# Altium project Main.PrjPcb
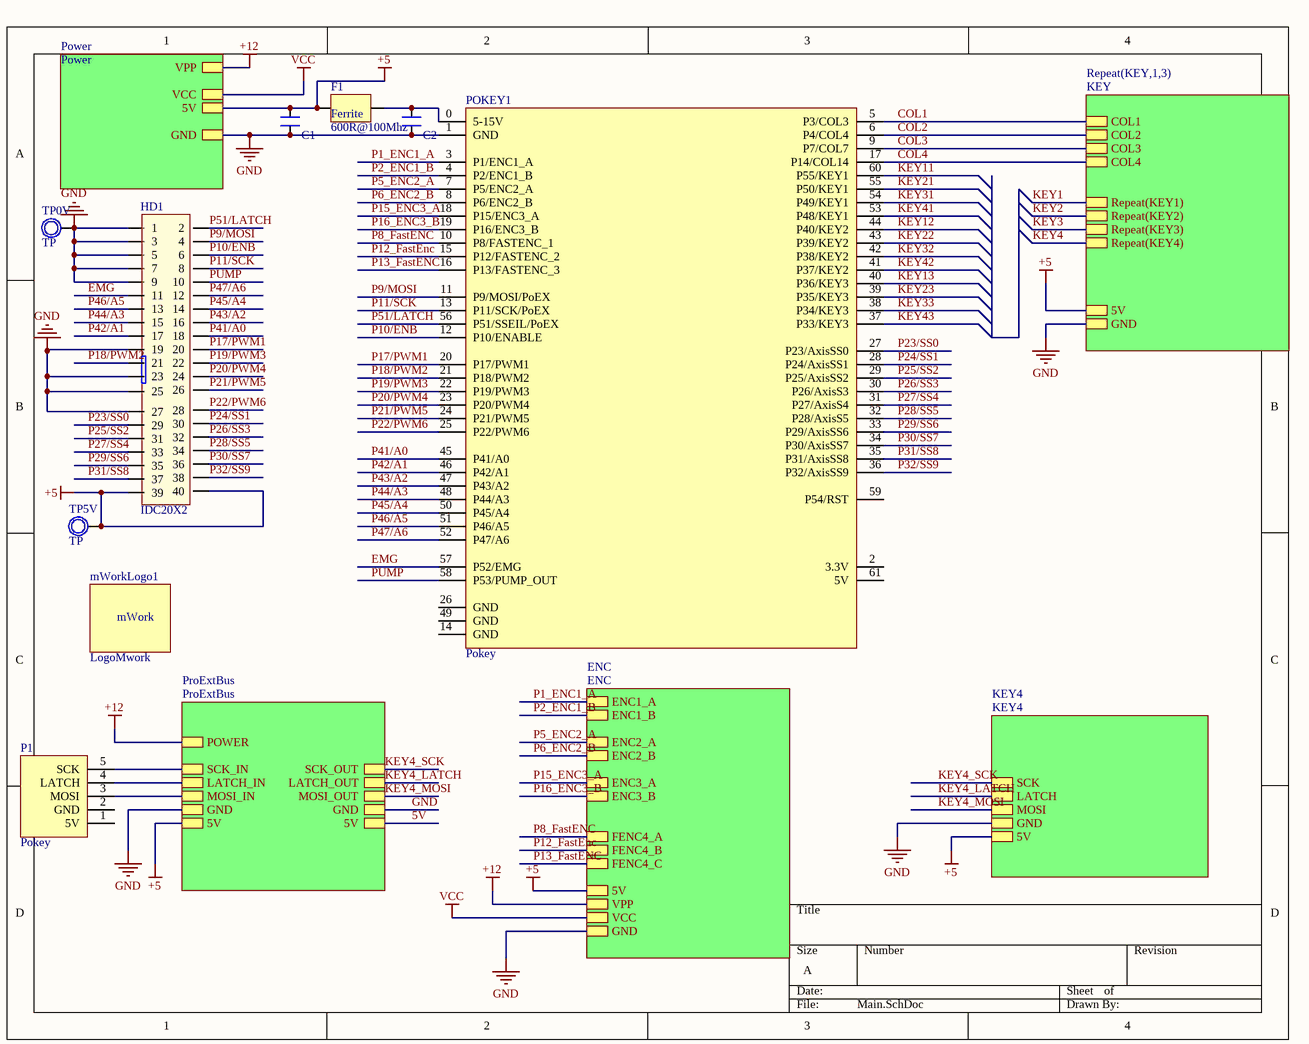
[diagram p0: Main.SchDoc]
9 sheets, 249 parts. Net scope: hierarchical (ports join the sheet entries above them; power ports are global).
Board file: PokeyMain.PcbDoc
Sheets:
  Main.SchDoc
    Power = Power.SchDoc
    ProExtBus = ProExtBus.SchDoc
      Led1 = Led.SchDoc
      Led2 = Led.SchDoc
      Led3 = Led.SchDoc
      Led4 = Led.SchDoc
      Led5 = Led.SchDoc
      Led6 = Led.SchDoc
      Led7 = Led.SchDoc
      Led8 = Led.SchDoc
      Led9 = Led.SchDoc
      Led10 = Led.SchDoc
      Led11 = Led.SchDoc
      Led12 = Led.SchDoc
      Led13 = Led.SchDoc
      Led14 = Led.SchDoc
      Led15 = Led.SchDoc
      Led16 = Led.SchDoc
      Led17 = Led.SchDoc
      Led18 = Led.SchDoc
      Led19 = Led.SchDoc
      Led20 = Led.SchDoc
      Led21 = Led.SchDoc
      Led22 = Led.SchDoc
      Led23 = Led.SchDoc
      Led24 = Led.SchDoc
      Led25 = Led.SchDoc
      Led26 = Led.SchDoc
      Led27 = Led.SchDoc
      Led28 = Led.SchDoc
      Led29 = Led.SchDoc
      Led30 = Led.SchDoc
      Led31 = Led.SchDoc
      Led32 = Led.SchDoc
    ENC = ENC.SchDoc
      Photo1 = Photo.SchDoc
      Photo2 = Photo.SchDoc
      Photo3 = Photo.SchDoc
      Photo = Photo3.SchDoc
    KEY1 = KEY.SchDoc
    KEY2 = KEY.SchDoc
    KEY3 = KEY.SchDoc
    KEY4 = KEY4.SchDoc

## Sheet Main.SchDoc
size A

### Parts
C1  CN  [CN-SMD-0603_big]  (value not drawn)
C2  CN  [CN-SMD-0603_big]  (value not drawn)
F1  600R@100Mhz  [Capacitor_805]
HD1  IDC20X2  [IDC40]
mWorkLogo1  LogoMwork  [LogoMwork30*12]
P1  Pokey  [JACK5]
POKEY1  Pokey  [POKEY]
TP0V  TP  [TP1]
TP5V  TP  [TP1]

### Sub-sheets
ENC = ENC: ENC1_A, ENC1_B, ENC2_A, ENC2_B, ENC3_A, ENC3_B, FENC4_A, FENC4_B, FENC4_C, VPP, VCC, GND, 5V
KEY4 = KEY4: SCK, LATCH, MOSI, GND, 5V
Power = Power: 5V, GND, VPP, VCC
ProExtBus = ProExtBus: SCK_IN, LATCH_IN, MOSI_IN, GND, 5V, SCK_OUT, LATCH_OUT, MOSI_OUT, GND, 5V, POWER
Repeat(KEY,1,3) = KEY: COL1, COL2, COL3, COL4, Repeat(KEY1), Repeat(KEY2), Repeat(KEY3), Repeat(KEY4), 5V, GND

### Nets
5V: C1.2 F1.1 HD1.39 HD1.40 TP5V.1 ; sheet Power/5V, sheet Power/VCC, sheet ProExtBus/5V, sheet ProExtBus/5V, sheet ENC/VCC, sheet ENC/5V, sheet Repeat(KEY,1,3)/5V, sheet KEY4/5V  [also labelled +5, VCC]
+12: sheet Power/VPP, sheet ProExtBus/POWER, sheet ENC/VPP
GND: C1.1 C2.1 HD1.1 HD1.3 HD1.5 HD1.7 HD1.9 HD1.19 HD1.23 HD1.25 HD1.27 POKEY1.1(GND) TP0V.1 ; sheet Power/GND, sheet ProExtBus/GND, sheet ProExtBus/GND, sheet ENC/GND, sheet Repeat(KEY,1,3)/GND, sheet KEY4/GND
COL1: POKEY1.5(P3/COL3) ; sheet Repeat(KEY,1,3)/COL1
COL2: POKEY1.6(P4/COL4) ; sheet Repeat(KEY,1,3)/COL2
COL3: POKEY1.9(P7/COL7) ; sheet Repeat(KEY,1,3)/COL3
COL4: POKEY1.17(P14/COL14) ; sheet Repeat(KEY,1,3)/COL4
EMG: HD1.11 POKEY1.57(P52/EMG)
KEY1: sheet Repeat(KEY,1,3)/Repeat(KEY1)
KEY2: sheet Repeat(KEY,1,3)/Repeat(KEY2)
KEY3: sheet Repeat(KEY,1,3)/Repeat(KEY3)
KEY4: sheet Repeat(KEY,1,3)/Repeat(KEY4)
KEY4_LATCH: P1.4(LATCH) ; sheet ProExtBus/LATCH_IN, sheet ProExtBus/LATCH_OUT, sheet KEY4/LATCH
KEY4_MOSI: sheet ProExtBus/MOSI_OUT, sheet KEY4/MOSI
KEY4_SCK: P1.5(SCK) ; sheet ProExtBus/SCK_IN, sheet ProExtBus/SCK_OUT, sheet KEY4/SCK
KEY11: POKEY1.60(P55/KEY1)
KEY12: POKEY1.44(P40/KEY2)
KEY13: POKEY1.40(P36/KEY3)
KEY21: POKEY1.55(P50/KEY1)
KEY22: POKEY1.43(P39/KEY2)
KEY23: POKEY1.39(P35/KEY3)
KEY31: POKEY1.54(P49/KEY1)
KEY32: POKEY1.42(P38/KEY2)
KEY33: POKEY1.38(P34/KEY3)
KEY41: POKEY1.53(P48/KEY1)
KEY42: POKEY1.41(P37/KEY2)
KEY43: POKEY1.37(P33/KEY3)
P1_ENC1_A: POKEY1.3(P1/ENC1_A) ; sheet ENC/ENC1_A  [project net A1]
P2_ENC1_B: POKEY1.4(P2/ENC1_B) ; sheet ENC/ENC1_B  [project net B1]
P5_ENC2_A: POKEY1.7(P5/ENC2_A) ; sheet ENC/ENC2_A  [project net A2]
P6_ENC2_B: POKEY1.8(P6/ENC2_B) ; sheet ENC/ENC2_B  [project net B2]
P8_FastENC: POKEY1.10(P8/FASTENC_1) ; sheet ENC/FENC4_A
P9/MOSI: HD1.4 POKEY1.11(P9/MOSI/PoEX)
P10/ENB: HD1.6 POKEY1.12(P10/ENABLE)
P11/SCK: HD1.8 POKEY1.13(P11/SCK/PoEX)
P12_FastEnc: POKEY1.15(P12/FASTENC_2) ; sheet ENC/FENC4_B
P13_FastENC: POKEY1.16(P13/FASTENC_3) ; sheet ENC/FENC4_C
P15_ENC3_A: POKEY1.18(P15/ENC3_A) ; sheet ENC/ENC3_A  [project net A3]
P16_ENC3_B: POKEY1.19(P16/ENC3_B) ; sheet ENC/ENC3_B  [project net B3]
P17/PWM1: HD1.20 POKEY1.20(P17/PWM1)
P18/PWM2: HD1.21 POKEY1.21(P18/PWM2)
P19/PWM3: HD1.22 POKEY1.22(P19/PWM3)
P20/PWM4: HD1.24 POKEY1.23(P20/PWM4)
P21/PWM5: HD1.26 POKEY1.24(P21/PWM5)
P22/PWM6: HD1.28 POKEY1.25(P22/PWM6)
P23/SS0: HD1.29 POKEY1.27(P23/AxisSS0)
P24/SS1: HD1.30 POKEY1.28(P24/AxisSS1)
P25/SS2: HD1.31 POKEY1.29(P25/AxisSS2)
P26/SS3: HD1.32 POKEY1.30(P26/AxisS3)
P27/SS4: HD1.33 POKEY1.31(P27/AxisS4)
P28/SS5: HD1.34 POKEY1.32(P28/AxisS5)
P29/SS6: HD1.35 POKEY1.33(P29/AxisSS6)
P30/SS7: HD1.36 POKEY1.34(P30/AxisSS7)
P31/SS8: HD1.37 POKEY1.35(P31/AxisSS8)
P32/SS9: HD1.38 POKEY1.36(P32/AxisSS9)
P41/A0: HD1.18 POKEY1.45(P41/A0)
P42/A1: HD1.17 POKEY1.46(P42/A1)
P43/A2: HD1.16 POKEY1.47(P43/A2)
P44/A3: HD1.15 POKEY1.48(P44/A3)
P45/A4: HD1.14 POKEY1.50(P45/A4)
P46/A5: HD1.13 POKEY1.51(P46/A5)
P47/A6: HD1.12 POKEY1.52(P47/A6)
P51/LATCH: HD1.2 POKEY1.56(P51/SSEIL/PoEX)
PUMP: HD1.10 POKEY1.58(P53/PUMP_OUT)
NetC2_2: C2.2 F1.2 POKEY1.0(5-15V)
NetP1_3: P1.3(MOSI) ; sheet ProExtBus/MOSI_IN

Not connected (* = marked no-connect by the designer): P1 1(5V) 2(GND); POKEY1 2(3.3V) 14(GND) 26(GND) 49(GND) 59(P54/RST) 61(5V)

### Notes on the sheet
- (in symbol LogoMwork) mWork

### Library data of the parts
C1 C2 = CN: Value: 33pF
F1 = Ferrite
HD1 = IDC20X2: IDC 13x2; Value: Header 5x2
P1 = Pokey_Jack
TP0V TP5V = TP1: Test Point; Value: Test Point

## Sheet Power.SchDoc
size A
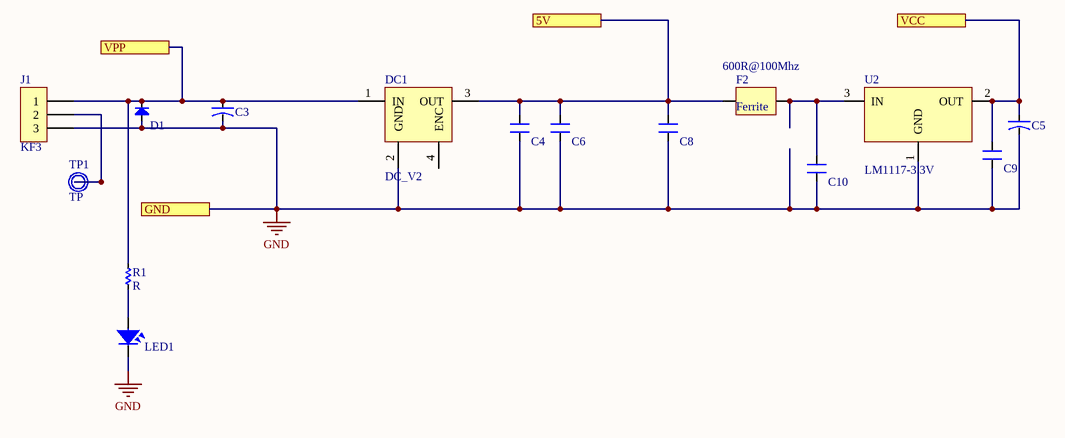
[diagram p1: Power.SchDoc]

### Parts
C3  CN-ALU-SMD  [CAP-ALU-SMD-F]  (value not drawn)
C4  CN  [CN-SMD-0603_big]  (value not drawn)
C5  CN-ALU-SMD  [CAP-ALU-SMD-F]  (value not drawn)
C6  CN  [CN-SMD-0603_big]  (value not drawn)
C8  CN  [CN-SMD-0603_big]  (value not drawn)
C9  CN  [CN-SMD-0603_big]  (value not drawn)
C10  CN  [CN-SMD-0603_big]  (value not drawn)
D1  Diode  [DIO-SMD-106-HayDung]  (value not drawn)
DC1  DC_V2  [DC_V2]
F2  600R@100Mhz  [Capacitor_805]
J1  KF3  [KF3-5.08T]
LED1  LED  [LED-0805-Red]  (value not drawn)
R1  R  [RES-SMD-0603_BIG]
TP1  TP  [TP1]
U2  LM1117-3.3V  [SOT223]

### Ports
5V, GND, VCC, VPP

### Nets
5V: C4.2 C5.1 C6.2 C8.2 C9.2 DC1.3(OUT) F2.1 U2.2(OUT) ; port 5V, port VCC
+12: C3.1 D1.2(K) DC1.1(IN) J1.1 R1.1 ; port VPP
GND: C3.2 C4.1 C5.2 C6.1 C8.1 C9.1 C10.1 D1.1(A) DC1.2(GND) J1.3 LED1.2 U2.1(GND) ; port GND
NetC10_2: C10.2 F2.2 U2.3(IN)
NetJ1_2: J1.2 TP1.1
NetLED1_1: LED1.1 R1.2

Not connected (* = marked no-connect by the designer): DC1 4(ENC)

### Library data of the parts
C3 C5 = CN-ALU-SMD: Polarized Capacitor (Axial); Published: 8-Jun-2000; LatestRevisionDate: 17-Jul-2002; LatestRevisionNote: Re-released for DXP Platform.; PackageReference: POLAR0.8; Publisher: Altium Limited
C4 C6 C8-C10 = CN: Value: 33pF
D1 = Diode: Default Diode; Code - JEDEC: DO-214-AB; Value: 1N5007; Published: 8-Jun-2000; Revision: July-2002: Re-released for DXP Platform.; Publisher: Altium Limited; ComponentLink1Description: ES1J - STMBL; ComponentLink1URL: https://banlinhkien.vn/goods-8089-es1j-do214-diode-1a-600v-sma-es1j-.html
DC1 = DC_Module_V2
F2 = Ferrite
J1 = KF3: Manufacturer: Würth Elektronik eiSos GmbH; partNo: 691103110003; ComponentLink1 Description: Manufacturer; ComponentLink2 Description: Datasheet; NoPins: 3; Created Date: 29 October 2013; ComponentLink1URL: http://www.we-online.com; ComponentLink2URL: http://katalog.we-online.de/em/datasheet/6911031100xx.pdf; Created by: Karrer Zheng
LED1 = LED SMD: Value: LED 3 - 5 ly 2 Colour
TP1 = TP1: Test Point; Value: Test Point
U2 = LM1117: 800mA Low-Dropout Linear Regulator; Creator: Nguyen Ba Bien; Website: http://group3i.net

## Sheet ProExtBus.SchDoc
size A
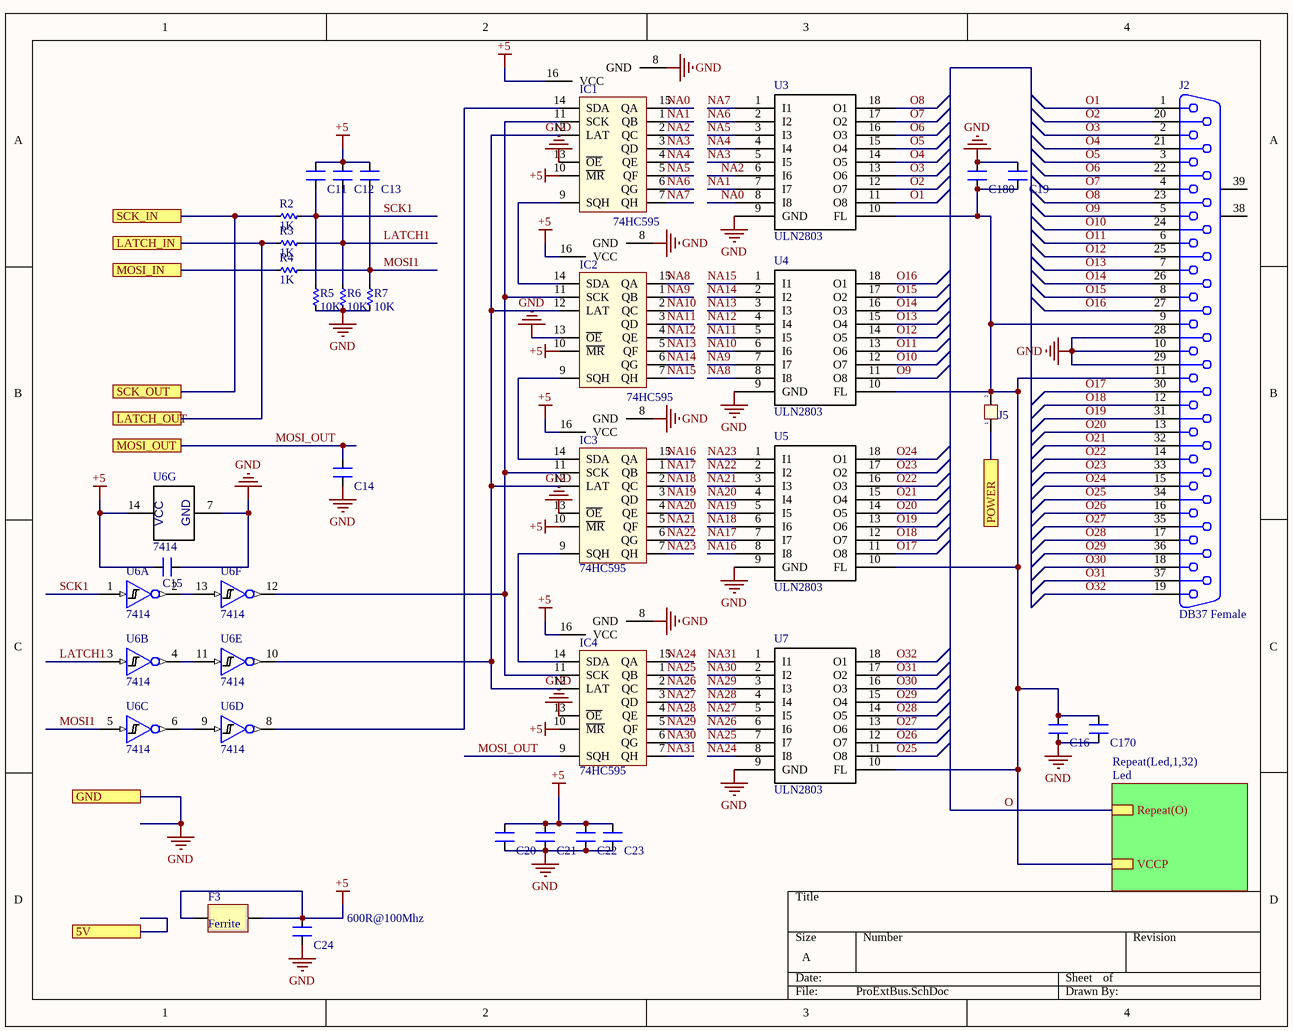
[diagram p2: ProExtBus.SchDoc]

### Parts
(Parts that share a designator on the sheet are numbered #1, #2 ... from top to bottom, then left to right.)
C11  1nF  [CN-SMD-0603_big]  (value not drawn)
C12  1nF  [CN-SMD-0603_big]  (value not drawn)
C13  1nF  [CN-SMD-0603_big]  (value not drawn)
C14  1nF  [CN-SMD-0603_big]  (value not drawn)
C15  CN  [CN-SMD-0603_big]  (value not drawn)
C16  CN  [CN-SMD-0603_big]  (value not drawn)
C19  CN  [CN-SMD-0603_big]  (value not drawn)
C20  CN  [CN-SMD-0603_big]  (value not drawn)
C21  CN  [CN-SMD-0603_big]  (value not drawn)
C22  CN  [CN-SMD-0603_big]  (value not drawn)
C23  CN  [CN-SMD-0603_big]  (value not drawn)
C24  CN  [CN-SMD-0603_big]  (value not drawn)
C170  CN  [CN-SMD-0603_big]  (value not drawn)
C180  CN  [CN-SMD-0603_big]  (value not drawn)
F3  600R@100Mhz  [Capacitor_805]
IC1  74HC595  [SO16]
IC2  74HC595  [SO16]
IC3  74HC595  [SO16]
IC4  74HC595  [SO16]
J2#1  DB37 Female  [DB37]
J5  Jumper 2  [JP2]  (value not drawn)
R2  1K  [RES-SMD-0603_BIG]
R3  1K  [RES-SMD-0603_BIG]
R4  1K  [RES-SMD-0603_BIG]
R5  10K  [RES-SMD-0603_BIG]
R6  10K  [RES-SMD-0603_BIG]
R7  10K  [RES-SMD-0603_BIG]
U3  ULN2803  [SO18]
U4  ULN2803  [SO18]
U5  ULN2803  [SO18]
U6  7414  [SO14]  (parts A,B,C,D,E,F,G of 7)
U7  ULN2803  [SO18]

### Sub-sheets
Repeat(Led,1,32) = Led: Repeat(O), VCCP

### Ports
5V, GND, LATCH_IN, LATCH_OUT, MOSI_IN, MOSI_OUT, POWER, SCK_IN, SCK_OUT

### Nets
+5: C11.2 C12.2 C13.2 C15.1 C20.2 C21.2 C22.2 C23.2 C24.2 F3.1 F3.2 IC1.10(~{MR}) IC1.16(VCC) IC2.10(~{MR}) IC2.16(VCC) IC3.10(~{MR}) IC3.16(VCC) IC4.10(~{MR}) IC4.16(VCC) U6.14(VCC) ; port 5V  [also labelled VCC]  [project net 5V]
+12: J5.1 ; port POWER
GND: C14.1 C15.2 C16.1 C19.2 C20.1 C21.1 C22.1 C23.1 C24.1 C170.1 C180.2 IC1.8(GND) IC1.13(~{OE}) IC2.8(GND) IC2.13(~{OE}) IC3.8(GND) IC3.13(~{OE}) IC4.8(GND) IC4.13(~{OE}) J2#1.10 J2#1.28 J2#1.29 R5.2 R6.2 R7.2 U3.9(GND) U4.9(GND) U5.9(GND) U6.7(GND) U7.9(GND) ; port GND
KEY4_LATCH: R3.2 ; port LATCH_IN, port LATCH_OUT
KEY4_SCK: R2.2 ; port SCK_IN, port SCK_OUT
LATCH1: C12.1 R3.1 R6.1 U6.3(A)
MOSI1: C13.1 R4.1 R7.1 U6.5(A)
MOSI_OUT: C14.2 IC4.9(SQH) ; port MOSI_OUT  [project net KEY4_MOSI]
NA0: IC1.15(QA) U3.8(I8)
NA1: IC1.1(QB) U3.7(I7)
NA2: IC1.2(QC) U3.6(I6)
NA3: IC1.3(QD) U3.5(I5)
NA4: IC1.4(QE) U3.4(I4)
NA5: IC1.5(QF) U3.3(I3)
NA6: IC1.6(QG) U3.2(I2)
NA7: IC1.7(QH) U3.1(I1)
NA8: IC2.15(QA) U4.8(I8)
NA9: IC2.1(QB) U4.7(I7)
NA10: IC2.2(QC) U4.6(I6)
NA11: IC2.3(QD) U4.5(I5)
NA12: IC2.4(QE) U4.4(I4)
NA13: IC2.5(QF) U4.3(I3)
NA14: IC2.6(QG) U4.2(I2)
NA15: IC2.7(QH) U4.1(I1)
NA16: IC3.15(QA) U5.8(I8)
NA17: IC3.1(QB) U5.7(I7)
NA18: IC3.2(QC) U5.6(I6)
NA19: IC3.3(QD) U5.5(I5)
NA20: IC3.4(QE) U5.4(I4)
NA21: IC3.5(QF) U5.3(I3)
NA22: IC3.6(QG) U5.2(I2)
NA23: IC3.7(QH) U5.1(I1)
NA24: IC4.15(QA) U7.8(I8)
NA25: IC4.1(QB) U7.7(I7)
NA26: IC4.2(QC) U7.6(I6)
NA27: IC4.3(QD) U7.5(I5)
NA28: IC4.4(QE) U7.4(I4)
NA29: IC4.5(QF) U7.3(I3)
NA30: IC4.6(QG) U7.2(I2)
NA31: IC4.7(QH) U7.1(I1)
O: sheet Repeat(Led,1,32)/Repeat(O)
O1: J2#1.1 U3.11(O8)
O2: J2#1.20 U3.12(O7)
O3: J2#1.2 U3.13(O6)
O4: J2#1.21 U3.14(O5)
O5: J2#1.3 U3.15(O4)
O6: J2#1.22 U3.16(O3)
O7: J2#1.4 U3.17(O2)
O8: J2#1.23 U3.18(O1)
O9: J2#1.5 U4.11(O8)
O10: J2#1.24 U4.12(O7)
O11: J2#1.6 U4.13(O6)
O12: J2#1.25 U4.14(O5)
O13: J2#1.7 U4.15(O4)
O14: J2#1.26 U4.16(O3)
O15: J2#1.8 U4.17(O2)
O16: J2#1.27 U4.18(O1)
O17: J2#1.30 U5.11(O8)
O18: J2#1.12 U5.12(O7)
O19: J2#1.31 U5.13(O6)
O20: J2#1.13 U5.14(O5)
O21: J2#1.32 U5.15(O4)
O22: J2#1.14 U5.16(O3)
O23: J2#1.33 U5.17(O2)
O24: J2#1.15 U5.18(O1)
O25: J2#1.34 U7.11(O8)
O26: J2#1.16 U7.12(O7)
O27: J2#1.35 U7.13(O6)
O28: J2#1.17 U7.14(O5)
O29: J2#1.36 U7.15(O4)
O30: J2#1.18 U7.16(O3)
O31: J2#1.37 U7.17(O2)
O32: J2#1.19 U7.18(O1)
SCK1: C11.1 R2.1 R5.1 U6.1(A)
NetC16_2: C16.2 C19.1 C170.2 C180.1 J2#1.9 J2#1.11 J5.2 U3.10(FL) U4.10(FL) U5.10(FL) U7.10(FL) ; sheet Repeat(Led,1,32)/VCCP
NetIC1_9: IC1.9(SQH) IC2.14(SDA)
NetIC1_11: IC1.11(SCK) IC2.11(SCK) IC3.11(SCK) IC4.11(SCK) U6.12(Y)
NetIC1_12: IC1.12(LAT) IC2.12(LAT) IC3.12(LAT) IC4.12(LAT) U6.10(Y)
NetIC1_14: IC1.14(SDA) U6.8(Y)
NetIC2_9: IC2.9(SQH) IC3.14(SDA)
NetIC3_9: IC3.9(SQH) IC4.14(SDA)
NetP1_3: R4.2 ; port MOSI_IN
NetU6_2: U6.2(Y) U6.13(A)
NetU6_4: U6.4(Y) U6.11(A)
NetU6_6: U6.6(Y) U6.9(A)

Not connected (* = marked no-connect by the designer): J2#1 38(MH1) 39(MH2)

### Library data of the parts
C11-C16 C19-C24 C170 C180 = CN: Value: 33pF
F3 = Ferrite
IC1-IC4 = 74595: 8 Bit Serial input - Parallel Output; Value: 74HC595
J5 = JP 2: Value: JP 2
R2-R7 = R
U3-U5 U7 = ULN2803: OCTAL HIGH CURRENT DRIVER; Manufacturer: Texas Instruments; Manufacturer Part Number: ULN2803ADWR; Number of Drivers/Receivers: 8/0; Voltage - Supply: 5V; Supplier 1: Digi-Key; Supplier Part Number 1: 296-15777-1-ND; Packaging: Cut Tape (CT); Supplier Part Number: 296-15777-1-ND; Type: Darlington Array; Supplier: Digi-Key; Protocol: -; Package / Case: 18-SOIC (7.5mm Width); Category: Integrated Circuits (ICs); RoHS: RoHS Compliant
U6 = 7414: IC, M74HC04M, Hex Inverter, SO-14; Text Field1: ST; Text Field2: M74HC04M1R; Text Field3: Mouser; Text Field4: 511-M74HC04M; Text Field6: .22; Text Field5: SO-14; NI?: *; O?: *; Section:: *

## Sheet Led.SchDoc
size A
Used 32 times, as channels ProExtBus/Led1, ProExtBus/Led2, ProExtBus/Led3, ProExtBus/Led4, ProExtBus/Led5, ProExtBus/Led6, ProExtBus/Led7, ProExtBus/Led8, ProExtBus/Led9, ProExtBus/Led10, ProExtBus/Led11, ProExtBus/Led12, ProExtBus/Led13, ProExtBus/Led14, ProExtBus/Led15, ProExtBus/Led16, ProExtBus/Led17, ProExtBus/Led18, ProExtBus/Led19, ProExtBus/Led20, ProExtBus/Led21, ProExtBus/Led22, ProExtBus/Led23, ProExtBus/Led24, ProExtBus/Led25, ProExtBus/Led26, ProExtBus/Led27, ProExtBus/Led28, ProExtBus/Led29, ProExtBus/Led30, ProExtBus/Led31, ProExtBus/Led32. Parts and nets are listed once, with the designators drawn on the sheet.
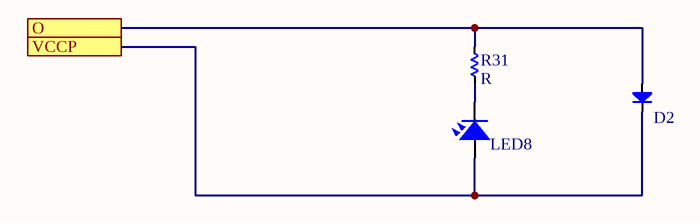
[diagram p3: Led.SchDoc]

### Parts
D2  Diode  [DIO-SMD-123]  (value not drawn)
LED8  LED  [LED-0805-Blue]  (value not drawn)
R31  R  [RES-SMD-0603_BIG]

### Ports
O, VCCP

### Nets
O: D2.1(A) R31.1 ; port O
VCCP: D2.2(K) LED8.1 ; port VCCP
NetLED8_2: LED8.2 R31.2

### Channels
ProExtBus/Led1: designators end in _Led1; ports O=O1 VCCP=NetC16_2
ProExtBus/Led2: designators end in _Led2; ports O=O2 VCCP=NetC16_2
ProExtBus/Led3: designators end in _Led3; ports O=O3 VCCP=NetC16_2
ProExtBus/Led4: designators end in _Led4; ports O=O4 VCCP=NetC16_2
ProExtBus/Led5: designators end in _Led5; ports O=O5 VCCP=NetC16_2
ProExtBus/Led6: designators end in _Led6; ports O=O6 VCCP=NetC16_2
ProExtBus/Led7: designators end in _Led7; ports O=O7 VCCP=NetC16_2
ProExtBus/Led8: designators end in _Led8; ports O=O8 VCCP=NetC16_2
ProExtBus/Led9: designators end in _Led9; ports O=O9 VCCP=NetC16_2
ProExtBus/Led10: designators end in _Led10; ports O=O10 VCCP=NetC16_2
ProExtBus/Led11: designators end in _Led11; ports O=O11 VCCP=NetC16_2
ProExtBus/Led12: designators end in _Led12; ports O=O12 VCCP=NetC16_2
ProExtBus/Led13: designators end in _Led13; ports O=O13 VCCP=NetC16_2
ProExtBus/Led14: designators end in _Led14; ports O=O14 VCCP=NetC16_2
ProExtBus/Led15: designators end in _Led15; ports O=O15 VCCP=NetC16_2
ProExtBus/Led16: designators end in _Led16; ports O=O16 VCCP=NetC16_2
ProExtBus/Led17: designators end in _Led17; ports O=O17 VCCP=NetC16_2
ProExtBus/Led18: designators end in _Led18; ports O=O18 VCCP=NetC16_2
ProExtBus/Led19: designators end in _Led19; ports O=O19 VCCP=NetC16_2
ProExtBus/Led20: designators end in _Led20; ports O=O20 VCCP=NetC16_2
ProExtBus/Led21: designators end in _Led21; ports O=O21 VCCP=NetC16_2
ProExtBus/Led22: designators end in _Led22; ports O=O22 VCCP=NetC16_2
ProExtBus/Led23: designators end in _Led23; ports O=O23 VCCP=NetC16_2
ProExtBus/Led24: designators end in _Led24; ports O=O24 VCCP=NetC16_2
ProExtBus/Led25: designators end in _Led25; ports O=O25 VCCP=NetC16_2
ProExtBus/Led26: designators end in _Led26; ports O=O26 VCCP=NetC16_2
ProExtBus/Led27: designators end in _Led27; ports O=O27 VCCP=NetC16_2
ProExtBus/Led28: designators end in _Led28; ports O=O28 VCCP=NetC16_2
ProExtBus/Led29: designators end in _Led29; ports O=O29 VCCP=NetC16_2
ProExtBus/Led30: designators end in _Led30; ports O=O30 VCCP=NetC16_2
ProExtBus/Led31: designators end in _Led31; ports O=O31 VCCP=NetC16_2
ProExtBus/Led32: designators end in _Led32; ports O=O32 VCCP=NetC16_2

### Library data of the parts
D2 = Diode: as D1 on sheet Power; Published: 8-Jun-2000; Revision: July-2002: Re-released for DXP Platform.; Publisher: Altium Limited; ComponentLink1Description: ES1J - STMBL; ComponentLink1URL: https://banlinhkien.vn/goods-8089-es1j-do214-diode-1a-600v-sma-es1j-.html
LED8 = LED SMD: Value: LED 3 - 5 ly 2 Colour

## Sheet ENC.SchDoc
size A
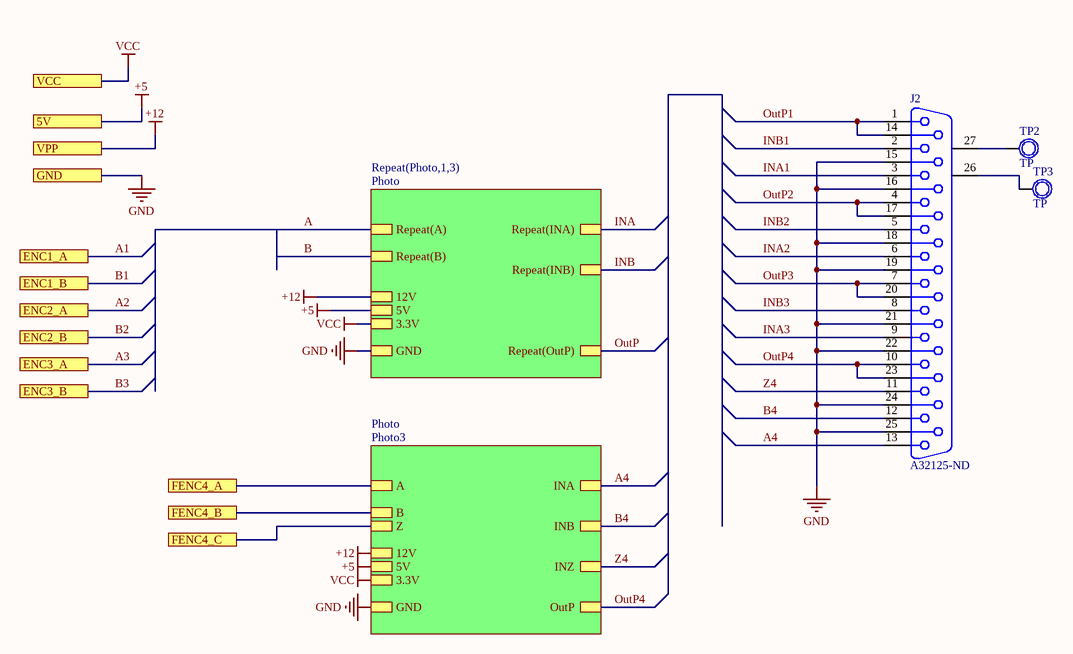
[diagram p4: ENC.SchDoc]

### Parts
(Parts that share a designator on the sheet are numbered #1, #2 ... from top to bottom, then left to right.)
J2#2  A32125-ND  [DB25]
TP2  TP  [TP1]
TP3  TP  [TP1]

### Sub-sheets
Photo = Photo3: B, A, INB, INA, 12V, 5V, 3.3V, GND, Z, INZ, OutP
Repeat(Photo,1,3) = Photo: Repeat(B), Repeat(A), Repeat(INB), Repeat(INA), 12V, 5V, 3.3V, GND, Repeat(OutP)

### Ports
5V, ENC1_A, ENC1_B, ENC2_A, ENC2_B, ENC3_A, ENC3_B, FENC4_A, FENC4_B, FENC4_C, GND, VCC, VPP

### Nets
+5: port VCC, port 5V, sheet Repeat(Photo,1,3)/5V, sheet Repeat(Photo,1,3)/3.3V, sheet Photo/5V, sheet Photo/3.3V  [also labelled VCC]  [project net 5V]
+12: port VPP, sheet Repeat(Photo,1,3)/12V, sheet Photo/12V
GND: J2#2.15 J2#2.16 J2#2.18 J2#2.19 J2#2.21 J2#2.22 J2#2.24 J2#2.25 ; port GND, sheet Repeat(Photo,1,3)/GND, sheet Photo/GND
A: sheet Repeat(Photo,1,3)/Repeat(A)
A4: J2#2.13 ; sheet Photo/INA
B: sheet Repeat(Photo,1,3)/Repeat(B)
B4: J2#2.12 ; sheet Photo/INB
INA: sheet Repeat(Photo,1,3)/Repeat(INA)
INA1: J2#2.3
INA2: J2#2.6
INA3: J2#2.9
INB: sheet Repeat(Photo,1,3)/Repeat(INB)
INB1: J2#2.2
INB2: J2#2.5
INB3: J2#2.8
OutP: sheet Repeat(Photo,1,3)/Repeat(OutP)
OutP1: J2#2.1 J2#2.14
OutP2: J2#2.4 J2#2.17
OutP3: J2#2.7 J2#2.20
OutP4: J2#2.10 J2#2.23 ; sheet Photo/OutP
P8_FastENC: port FENC4_A, sheet Photo/A
P12_FastEnc: port FENC4_B, sheet Photo/B
P13_FastENC: port FENC4_C, sheet Photo/Z
Z4: J2#2.11 ; sheet Photo/INZ
NetJ2#2_26: J2#2.26(MH1) TP3.1
NetJ2#2_27: J2#2.27(MH2) TP2.1

### Library data of the parts
J2#2 = DB25: Receptacle Assembly, Size 3, 25 Position, Right Angle, .318 Series, Amplimite; Positions: 25; MatingConnector: 4-40 Threaded Insert; PCB_Layout: Complies with manufacturer's recommendation.; DrillSize: Corresponds to nominal value.; ComponentAvailability: Obsolete; Published: 15-Jun-2001; LatestRevisionDate: 17-Jul-2002; LatestRevisionNote: Re-released for DXP Platform.; DatasheetDocument: 19-Mar-1999; PackageDocument: 19-Mar-1999; PackageReference: 787202-4; Publisher: Altium Limited; Orientation: Right Angle; Gender: Receptacle; ShellSize: 3; ComponentLink1Description: Manufacturer Link; ComponentLink1URL: http://www.tycoelectronics.com/
TP2 TP3 = TP1: Test Point; Value: Test Point

## Sheet Photo.SchDoc
size A
Used 3 times, as channels ENC/Photo1, ENC/Photo2, ENC/Photo3. Parts and nets are listed once, with the designators drawn on the sheet.
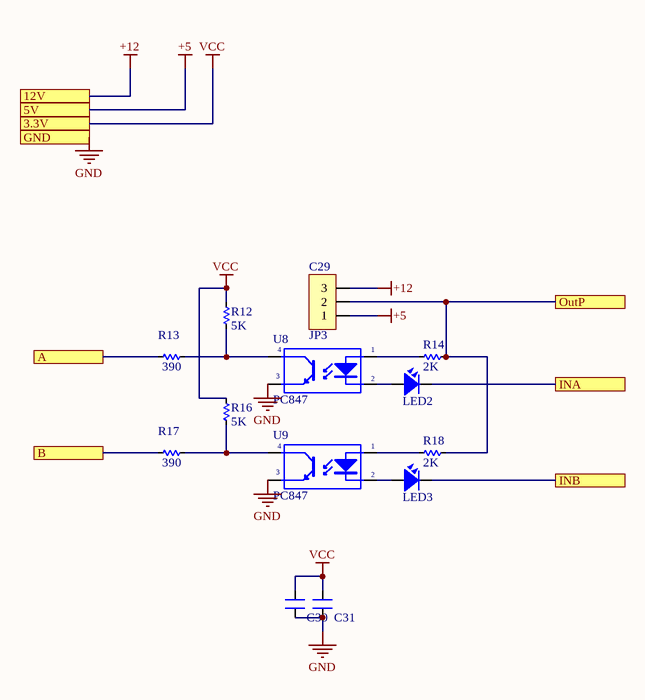
[diagram p5: Photo.SchDoc]

### Parts
C29  JP3  [JP3-C1T]
C30  100nF  [CN-SMD-0603_big]  (value not drawn)
C31  100nF  [CN-SMD-0603_big]  (value not drawn)
LED2  LED  [LED-0805-Green]  (value not drawn)
LED3  LED  [LED-0805-Green]  (value not drawn)
R12  5K  [RES-SMD-0603_BIG]
R13  390  [RES-SMD-0603_BIG]
R14  2K  [RES-SMD-0603_BIG]
R16  5K  [RES-SMD-0603_BIG]
R17  390  [RES-SMD-0603_BIG]
R18  2K  [RES-SMD-0603_BIG]
U8  PC847  [DIP4]
U9  PC847  [DIP4]

### Ports
3.3V, 5V, 12V, A, B, GND, INA, INB, OutP

### Nets
+5: C29.1 ; port 5V
+12: C29.3 ; port 12V
GND: C30.1 C31.1 U8.3(E) U9.3(E) ; port GND
VCC: C30.2 C31.2 R12.1 R16.1 ; port 3.3V
A: R13.1 ; port A
B: R17.1 ; port B
INA: LED2.2 ; port INA
INB: LED3.2 ; port INB
OutP: C29.2 R14.1 R18.1 ; port OutP
NetLED2_1: LED2.1 U8.2(K)
NetLED3_1: LED3.1 U9.2(K)
NetR12_2: R12.2 R13.2 U8.4(C)
NetR14_2: R14.2 U8.1(A)
NetR16_2: R16.2 R17.2 U9.4(C)
NetR18_2: R18.2 U9.1(A)

### Channels
ENC/Photo1: designators end in _Photo1; ports 3.3V=5V 5V=5V 12V=+12 A=A1 B=B1 GND=GND INA=INA1 INB=INB1 OutP=OutP1
ENC/Photo2: designators end in _Photo2; ports 3.3V=5V 5V=5V 12V=+12 A=A2 B=B2 GND=GND INA=INA2 INB=INB2 OutP=OutP2
ENC/Photo3: designators end in _Photo3; ports 3.3V=5V 5V=5V 12V=+12 A=A3 B=B3 GND=GND INA=INA3 INB=INB3 OutP=OutP3

### Library data of the parts
C29 = JP3: WR-PHD 2.54 mm Angled Socket Header; Manufacturer: W¨¹rth Elektronik eiSos GmbH; partNo: 613003143121; ComponentLink1 Description: Manufacturer; ComponentLink2 Description: Datasheet; NoPins: 03; Created Date: 29 March 2013; ComponentLink1URL: http://www.we-online.com; ComponentLink2URL: http://katalog.we-online.de/em/datasheet/6130xx143121.pdf; Created by: Karrer Zheng
C30 C31 = CN: Value: 33pF
LED2 LED3 = LED SMD: Value: LED 3 - 5 ly 2 Colour
R12-R14 R16-R18 = R
U8 U9 = PC817: Single Opto; Value: PC817

## Sheet Photo3.SchDoc
size A
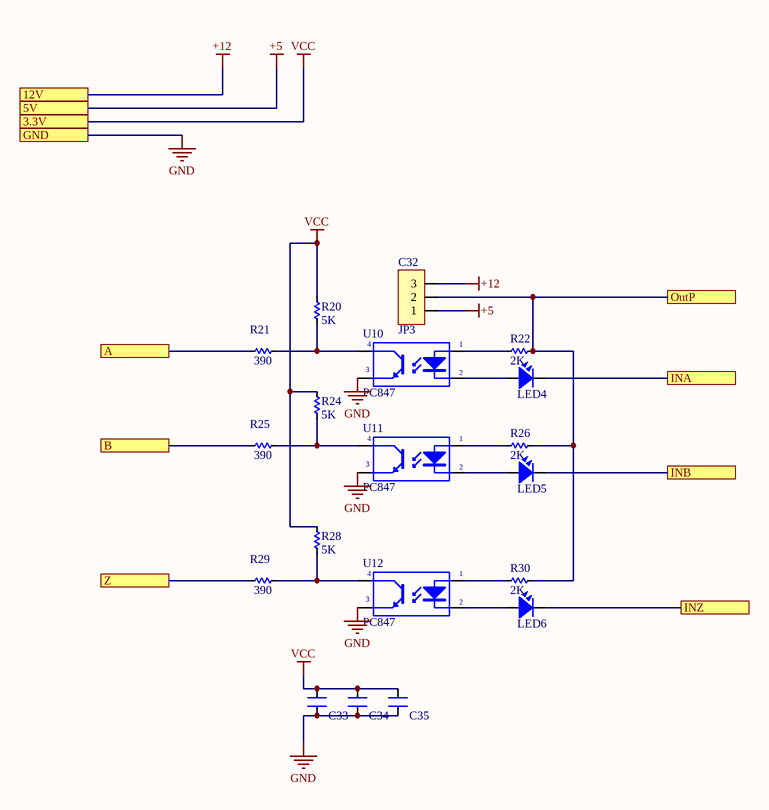
[diagram p6: Photo3.SchDoc]

### Parts
C32  JP3  [JP3-C1T]
C33  100nF  [CN-SMD-0603_big]  (value not drawn)
C34  CN  [CN-SMD-0603_big]  (value not drawn)
C35  CN  [CN-SMD-0603_big]  (value not drawn)
LED4  LED  [LED-0805-Green]  (value not drawn)
LED5  LED  [LED-0805-Green]  (value not drawn)
LED6  LED  [LED-0805-Green]  (value not drawn)
R20  5K  [RES-SMD-0603_BIG]
R21  390  [RES-SMD-0603_BIG]
R22  2K  [RES-SMD-0603_BIG]
R24  5K  [RES-SMD-0603_BIG]
R25  390  [RES-SMD-0603_BIG]
R26  2K  [RES-SMD-0603_BIG]
R28  5K  [RES-SMD-0603_BIG]
R29  390  [RES-SMD-0603_BIG]
R30  2K  [RES-SMD-0603_BIG]
U10  PC847  [DIP4]
U11  PC847  [DIP4]
U12  PC847  [DIP4]

### Ports
3.3V, 5V, 12V, A, B, GND, INA, INB, INZ, OutP, Z

### Nets
+5: C32.1 C33.2 C34.2 C35.2 R20.1 R24.1 R28.1 ; port 5V, port 3.3V  [also labelled VCC]  [project net 5V]
+12: C32.3 ; port 12V
GND: C33.1 C34.1 C35.1 U10.3(E) U11.3(E) U12.3(E) ; port GND
A4: LED4.2 ; port INA
B4: LED5.2 ; port INB
OutP4: C32.2 R22.1 R26.1 R30.1 ; port OutP
P8_FastENC: R21.1 ; port A
P12_FastEnc: R25.1 ; port B
P13_FastENC: R29.1 ; port Z
Z4: LED6.2 ; port INZ
NetLED4_1: LED4.1 U10.2(K)
NetLED5_1: LED5.1 U11.2(K)
NetLED6_1: LED6.1 U12.2(K)
NetR20_2: R20.2 R21.2 U10.4(C)
NetR22_2: R22.2 U10.1(A)
NetR24_2: R24.2 R25.2 U11.4(C)
NetR26_2: R26.2 U11.1(A)
NetR28_2: R28.2 R29.2 U12.4(C)
NetR30_2: R30.2 U12.1(A)

### Library data of the parts
C32 = JP3: as C29 on sheet Photo; Created Date: 29 March 2013; ComponentLink1URL: http://www.we-online.com; ComponentLink2URL: http://katalog.we-online.de/em/datasheet/6130xx143121.pdf; Created by: Karrer Zheng
C33-C35 = CN: Value: 33pF
LED4-LED6 = LED SMD: Value: LED 3 - 5 ly 2 Colour
R20-R22 R24-R26 R28-R30 = R
U10-U12 = PC817: Single Opto; Value: PC817

## Sheet KEY.SchDoc
size A
Used 3 times, as channels KEY1, KEY2, KEY3. Parts and nets are listed once, with the designators drawn on the sheet.
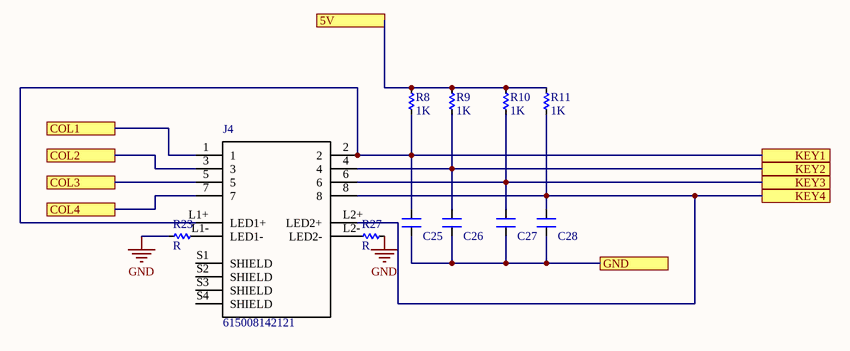
[diagram p7: KEY.SchDoc]

### Parts
C25  CN  [CN-SMD-0603_big]  (value not drawn)
C26  CN  [CN-SMD-0603_big]  (value not drawn)
C27  CN  [CN-SMD-0603_big]  (value not drawn)
C28  CN  [CN-SMD-0603_big]  (value not drawn)
J4  615008142121  [RJ45_8P8C]
R8  1K  [RES-SMD-0603_BIG]
R9  1K  [RES-SMD-0603_BIG]
R10  1K  [RES-SMD-0603_BIG]
R11  1K  [RES-SMD-0603_BIG]
R23  R  [RES-SMD-0603_BIG]
R27  R  [RES-SMD-0603_BIG]

### Ports
5V, COL1, COL2, COL3, COL4, GND, KEY1, KEY2, KEY3, KEY4

### Nets
GND: R23.2 R27.1
5V: R8.1 R9.1 R10.1 R11.1 ; port 5V
COL1: J4.1 ; port COL1
COL2: J4.3 ; port COL2
COL3: J4.5 ; port COL3
COL4: J4.7 ; port COL4
GND: C25.1 C26.1 C27.1 C28.1 ; port GND  [a separate net that carries the same name]
KEY1: C25.2 J4.2 J4.L1+(LED1+) R8.2 ; port KEY1
KEY2: C26.2 J4.4 R9.2 ; port KEY2
KEY3: C27.2 J4.6 R10.2 ; port KEY3
KEY4: C28.2 J4.8 J4.L2+(LED2+) R11.2 ; port KEY4
NetJ4_L1-: J4.L1-(LED1-) R23.1
NetJ4_L2-: J4.L2-(LED2-) R27.2

Not connected (* = marked no-connect by the designer): J4 S1(SHIELD) S2(SHIELD) S3(SHIELD) S4(SHIELD)

### Channels
KEY1: designators end in _KEY1; ports 5V=5V COL1=COL1 COL2=COL2 COL3=COL3 COL4=COL4 GND=GND KEY1=KEY11 KEY2=KEY21 KEY3=KEY31 KEY4=KEY41
KEY2: designators end in _KEY2; ports 5V=5V COL1=COL1 COL2=COL2 COL3=COL3 COL4=COL4 GND=GND KEY1=KEY12 KEY2=KEY22 KEY3=KEY32 KEY4=KEY42
KEY3: designators end in _KEY3; ports 5V=5V COL1=COL1 COL2=COL2 COL3=COL3 COL4=COL4 GND=GND KEY1=KEY13 KEY2=KEY23 KEY3=KEY33 KEY4=KEY43

### Library data of the parts
C25-C28 = CN: Value: 33pF
J4 = RJ45_8P8C: Conn, Rj45 Jack, Shld, 1port, 8p8c, Cat5; MF: WÃ¼rth Elektronik; MP: 615008142121; Price: None; Availability: Unavailable; SnapEDA_Link: https://www.snapeda.com/parts/615008142121/W%C3%BCrth%20Elektronik/view-part/1118273/?ref=snap; Package: None; Value: *
R8-R11 = R

## Sheet KEY4.SchDoc
size A
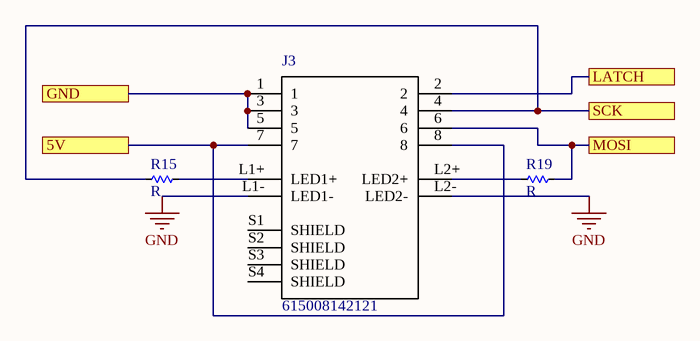
[diagram p8: KEY4.SchDoc]

### Parts
J3  615008142121  [RJ45_8P8C]
R15  R  [RES-SMD-0603_BIG]
R19  R  [RES-SMD-0603_BIG]

### Ports
5V, GND, LATCH, MOSI, SCK

### Nets
5V: J3.7 J3.8 ; port 5V
GND: J3.1 J3.3 J3.5 J3.L1-(LED1-) J3.L2-(LED2-) ; port GND
KEY4_LATCH: J3.2 ; port LATCH
KEY4_MOSI: J3.6 R19.1 ; port MOSI
KEY4_SCK: J3.4 R15.2 ; port SCK
NetJ3_L1+: J3.L1+(LED1+) R15.1
NetJ3_L2+: J3.L2+(LED2+) R19.2

Not connected (* = marked no-connect by the designer): J3 S1(SHIELD) S2(SHIELD) S3(SHIELD) S4(SHIELD)

### Library data of the parts
J3 = RJ45_8P8C: as J4 on sheet KEY; MP: 615008142121; Price: None; Availability: Unavailable; SnapEDA_Link: https://www.snapeda.com/parts/615008142121/W%C3%BCrth%20Elektronik/view-part/1118273/?ref=snap; Package: None; Value: *

## Nets that join several sheets
5V: Main (5 pins), Power (8 pins), ProExtBus (20 pins), ENC/Photo1 (5 pins), ENC/Photo2 (5 pins), ENC/Photo3 (5 pins), Photo3 (7 pins), KEY1 (R8_KEY1.1 R9_KEY1.1 R10_KEY1.1 R11_KEY1.1), KEY2 (R8_KEY2.1 R9_KEY2.1 R10_KEY2.1 R11_KEY2.1), KEY3 (R8_KEY3.1 R9_KEY3.1 R10_KEY3.1 R11_KEY3.1), KEY4 (J3.7 J3.8)
+12: Power (5 pins), ProExtBus (J5.1), ENC/Photo1 (C29_Photo1.3), ENC/Photo2 (C29_Photo2.3), ENC/Photo3 (C29_Photo3.3), Photo3 (C32.3)
GND: Main (13 pins), Power (12 pins), ProExtBus (30 pins), ENC (8 pins), ENC/Photo1 (C30_Photo1.1 C31_Photo1.1 U8_Photo1.3 U9_Photo1.3), ENC/Photo2 (C30_Photo2.1 C31_Photo2.1 U8_Photo2.3 U9_Photo2.3), ENC/Photo3 (C30_Photo3.1 C31_Photo3.1 U8_Photo3.3 U9_Photo3.3), Photo3 (6 pins), KEY1 (6 pins), KEY2 (6 pins), KEY3 (6 pins), KEY4 (5 pins)
A1: Main (POKEY1.3), ENC/Photo1 (R13_Photo1.1)
A2: Main (POKEY1.7), ENC/Photo2 (R13_Photo2.1)
A3: Main (POKEY1.18), ENC/Photo3 (R13_Photo3.1)
A4: ENC (J2#2.13), Photo3 (LED4.2)
B1: Main (POKEY1.4), ENC/Photo1 (R17_Photo1.1)
B2: Main (POKEY1.8), ENC/Photo2 (R17_Photo2.1)
B3: Main (POKEY1.19), ENC/Photo3 (R17_Photo3.1)
B4: ENC (J2#2.12), Photo3 (LED5.2)
COL1: Main (POKEY1.5), KEY1 (J4_KEY1.1), KEY2 (J4_KEY2.1), KEY3 (J4_KEY3.1)
COL2: Main (POKEY1.6), KEY1 (J4_KEY1.3), KEY2 (J4_KEY2.3), KEY3 (J4_KEY3.3)
COL3: Main (POKEY1.9), KEY1 (J4_KEY1.5), KEY2 (J4_KEY2.5), KEY3 (J4_KEY3.5)
COL4: Main (POKEY1.17), KEY1 (J4_KEY1.7), KEY2 (J4_KEY2.7), KEY3 (J4_KEY3.7)
INA1: ENC (J2#2.3), ENC/Photo1 (LED2_Photo1.2)
INA2: ENC (J2#2.6), ENC/Photo2 (LED2_Photo2.2)
INA3: ENC (J2#2.9), ENC/Photo3 (LED2_Photo3.2)
INB1: ENC (J2#2.2), ENC/Photo1 (LED3_Photo1.2)
INB2: ENC (J2#2.5), ENC/Photo2 (LED3_Photo2.2)
INB3: ENC (J2#2.8), ENC/Photo3 (LED3_Photo3.2)
KEY4_LATCH: Main (P1.4), ProExtBus (R3.2), KEY4 (J3.2)
KEY4_MOSI: ProExtBus (C14.2 IC4.9), KEY4 (J3.6 R19.1)
KEY4_SCK: Main (P1.5), ProExtBus (R2.2), KEY4 (J3.4 R15.2)
KEY11: Main (POKEY1.60), KEY1 (C25_KEY1.2 J4_KEY1.2 J4_KEY1.L1+ R8_KEY1.2)
KEY12: Main (POKEY1.44), KEY2 (C25_KEY2.2 J4_KEY2.2 J4_KEY2.L1+ R8_KEY2.2)
KEY13: Main (POKEY1.40), KEY3 (C25_KEY3.2 J4_KEY3.2 J4_KEY3.L1+ R8_KEY3.2)
KEY21: Main (POKEY1.55), KEY1 (C26_KEY1.2 J4_KEY1.4 R9_KEY1.2)
KEY22: Main (POKEY1.43), KEY2 (C26_KEY2.2 J4_KEY2.4 R9_KEY2.2)
KEY23: Main (POKEY1.39), KEY3 (C26_KEY3.2 J4_KEY3.4 R9_KEY3.2)
KEY31: Main (POKEY1.54), KEY1 (C27_KEY1.2 J4_KEY1.6 R10_KEY1.2)
KEY32: Main (POKEY1.42), KEY2 (C27_KEY2.2 J4_KEY2.6 R10_KEY2.2)
KEY33: Main (POKEY1.38), KEY3 (C27_KEY3.2 J4_KEY3.6 R10_KEY3.2)
KEY41: Main (POKEY1.53), KEY1 (C28_KEY1.2 J4_KEY1.8 J4_KEY1.L2+ R11_KEY1.2)
KEY42: Main (POKEY1.41), KEY2 (C28_KEY2.2 J4_KEY2.8 J4_KEY2.L2+ R11_KEY2.2)
KEY43: Main (POKEY1.37), KEY3 (C28_KEY3.2 J4_KEY3.8 J4_KEY3.L2+ R11_KEY3.2)
NetC16_2: ProExtBus (11 pins), ProExtBus/Led1 (D2_Led1.2 LED8_Led1.1), ProExtBus/Led2 (D2_Led2.2 LED8_Led2.1), ProExtBus/Led3 (D2_Led3.2 LED8_Led3.1), ProExtBus/Led4 (D2_Led4.2 LED8_Led4.1), ProExtBus/Led5 (D2_Led5.2 LED8_Led5.1), ProExtBus/Led6 (D2_Led6.2 LED8_Led6.1), ProExtBus/Led7 (D2_Led7.2 LED8_Led7.1), ProExtBus/Led8 (D2_Led8.2 LED8_Led8.1), ProExtBus/Led9 (D2_Led9.2 LED8_Led9.1), ProExtBus/Led10 (D2_Led10.2 LED8_Led10.1), ProExtBus/Led11 (D2_Led11.2 LED8_Led11.1), ProExtBus/Led12 (D2_Led12.2 LED8_Led12.1), ProExtBus/Led13 (D2_Led13.2 LED8_Led13.1), ProExtBus/Led14 (D2_Led14.2 LED8_Led14.1), ProExtBus/Led15 (D2_Led15.2 LED8_Led15.1), ProExtBus/Led16 (D2_Led16.2 LED8_Led16.1), ProExtBus/Led17 (D2_Led17.2 LED8_Led17.1), ProExtBus/Led18 (D2_Led18.2 LED8_Led18.1), ProExtBus/Led19 (D2_Led19.2 LED8_Led19.1), ProExtBus/Led20 (D2_Led20.2 LED8_Led20.1), ProExtBus/Led21 (D2_Led21.2 LED8_Led21.1), ProExtBus/Led22 (D2_Led22.2 LED8_Led22.1), ProExtBus/Led23 (D2_Led23.2 LED8_Led23.1), ProExtBus/Led24 (D2_Led24.2 LED8_Led24.1), ProExtBus/Led25 (D2_Led25.2 LED8_Led25.1), ProExtBus/Led26 (D2_Led26.2 LED8_Led26.1), ProExtBus/Led27 (D2_Led27.2 LED8_Led27.1), ProExtBus/Led28 (D2_Led28.2 LED8_Led28.1), ProExtBus/Led29 (D2_Led29.2 LED8_Led29.1), ProExtBus/Led30 (D2_Led30.2 LED8_Led30.1), ProExtBus/Led31 (D2_Led31.2 LED8_Led31.1), ProExtBus/Led32 (D2_Led32.2 LED8_Led32.1)
NetP1_3: Main (P1.3), ProExtBus (R4.2)
O1: ProExtBus (J2#1.1 U3.11), ProExtBus/Led1 (D2_Led1.1 R31_Led1.1)
O2: ProExtBus (J2#1.20 U3.12), ProExtBus/Led2 (D2_Led2.1 R31_Led2.1)
O3: ProExtBus (J2#1.2 U3.13), ProExtBus/Led3 (D2_Led3.1 R31_Led3.1)
O4: ProExtBus (J2#1.21 U3.14), ProExtBus/Led4 (D2_Led4.1 R31_Led4.1)
O5: ProExtBus (J2#1.3 U3.15), ProExtBus/Led5 (D2_Led5.1 R31_Led5.1)
O6: ProExtBus (J2#1.22 U3.16), ProExtBus/Led6 (D2_Led6.1 R31_Led6.1)
O7: ProExtBus (J2#1.4 U3.17), ProExtBus/Led7 (D2_Led7.1 R31_Led7.1)
O8: ProExtBus (J2#1.23 U3.18), ProExtBus/Led8 (D2_Led8.1 R31_Led8.1)
O9: ProExtBus (J2#1.5 U4.11), ProExtBus/Led9 (D2_Led9.1 R31_Led9.1)
O10: ProExtBus (J2#1.24 U4.12), ProExtBus/Led10 (D2_Led10.1 R31_Led10.1)
O11: ProExtBus (J2#1.6 U4.13), ProExtBus/Led11 (D2_Led11.1 R31_Led11.1)
O12: ProExtBus (J2#1.25 U4.14), ProExtBus/Led12 (D2_Led12.1 R31_Led12.1)
O13: ProExtBus (J2#1.7 U4.15), ProExtBus/Led13 (D2_Led13.1 R31_Led13.1)
O14: ProExtBus (J2#1.26 U4.16), ProExtBus/Led14 (D2_Led14.1 R31_Led14.1)
O15: ProExtBus (J2#1.8 U4.17), ProExtBus/Led15 (D2_Led15.1 R31_Led15.1)
O16: ProExtBus (J2#1.27 U4.18), ProExtBus/Led16 (D2_Led16.1 R31_Led16.1)
O17: ProExtBus (J2#1.30 U5.11), ProExtBus/Led17 (D2_Led17.1 R31_Led17.1)
O18: ProExtBus (J2#1.12 U5.12), ProExtBus/Led18 (D2_Led18.1 R31_Led18.1)
O19: ProExtBus (J2#1.31 U5.13), ProExtBus/Led19 (D2_Led19.1 R31_Led19.1)
O20: ProExtBus (J2#1.13 U5.14), ProExtBus/Led20 (D2_Led20.1 R31_Led20.1)
O21: ProExtBus (J2#1.32 U5.15), ProExtBus/Led21 (D2_Led21.1 R31_Led21.1)
O22: ProExtBus (J2#1.14 U5.16), ProExtBus/Led22 (D2_Led22.1 R31_Led22.1)
O23: ProExtBus (J2#1.33 U5.17), ProExtBus/Led23 (D2_Led23.1 R31_Led23.1)
O24: ProExtBus (J2#1.15 U5.18), ProExtBus/Led24 (D2_Led24.1 R31_Led24.1)
O25: ProExtBus (J2#1.34 U7.11), ProExtBus/Led25 (D2_Led25.1 R31_Led25.1)
O26: ProExtBus (J2#1.16 U7.12), ProExtBus/Led26 (D2_Led26.1 R31_Led26.1)
O27: ProExtBus (J2#1.35 U7.13), ProExtBus/Led27 (D2_Led27.1 R31_Led27.1)
O28: ProExtBus (J2#1.17 U7.14), ProExtBus/Led28 (D2_Led28.1 R31_Led28.1)
O29: ProExtBus (J2#1.36 U7.15), ProExtBus/Led29 (D2_Led29.1 R31_Led29.1)
O30: ProExtBus (J2#1.18 U7.16), ProExtBus/Led30 (D2_Led30.1 R31_Led30.1)
O31: ProExtBus (J2#1.37 U7.17), ProExtBus/Led31 (D2_Led31.1 R31_Led31.1)
O32: ProExtBus (J2#1.19 U7.18), ProExtBus/Led32 (D2_Led32.1 R31_Led32.1)
OutP1: ENC (J2#2.1 J2#2.14), ENC/Photo1 (C29_Photo1.2 R14_Photo1.1 R18_Photo1.1)
OutP2: ENC (J2#2.4 J2#2.17), ENC/Photo2 (C29_Photo2.2 R14_Photo2.1 R18_Photo2.1)
OutP3: ENC (J2#2.7 J2#2.20), ENC/Photo3 (C29_Photo3.2 R14_Photo3.1 R18_Photo3.1)
OutP4: ENC (J2#2.10 J2#2.23), Photo3 (C32.2 R22.1 R26.1 R30.1)
P8_FastENC: Main (POKEY1.10), Photo3 (R21.1)
P12_FastEnc: Main (POKEY1.15), Photo3 (R25.1)
P13_FastENC: Main (POKEY1.16), Photo3 (R29.1)
Z4: ENC (J2#2.11), Photo3 (LED6.2)